# EAGLE design USB-CAN-Adapter (EAGLE 7.7.0)
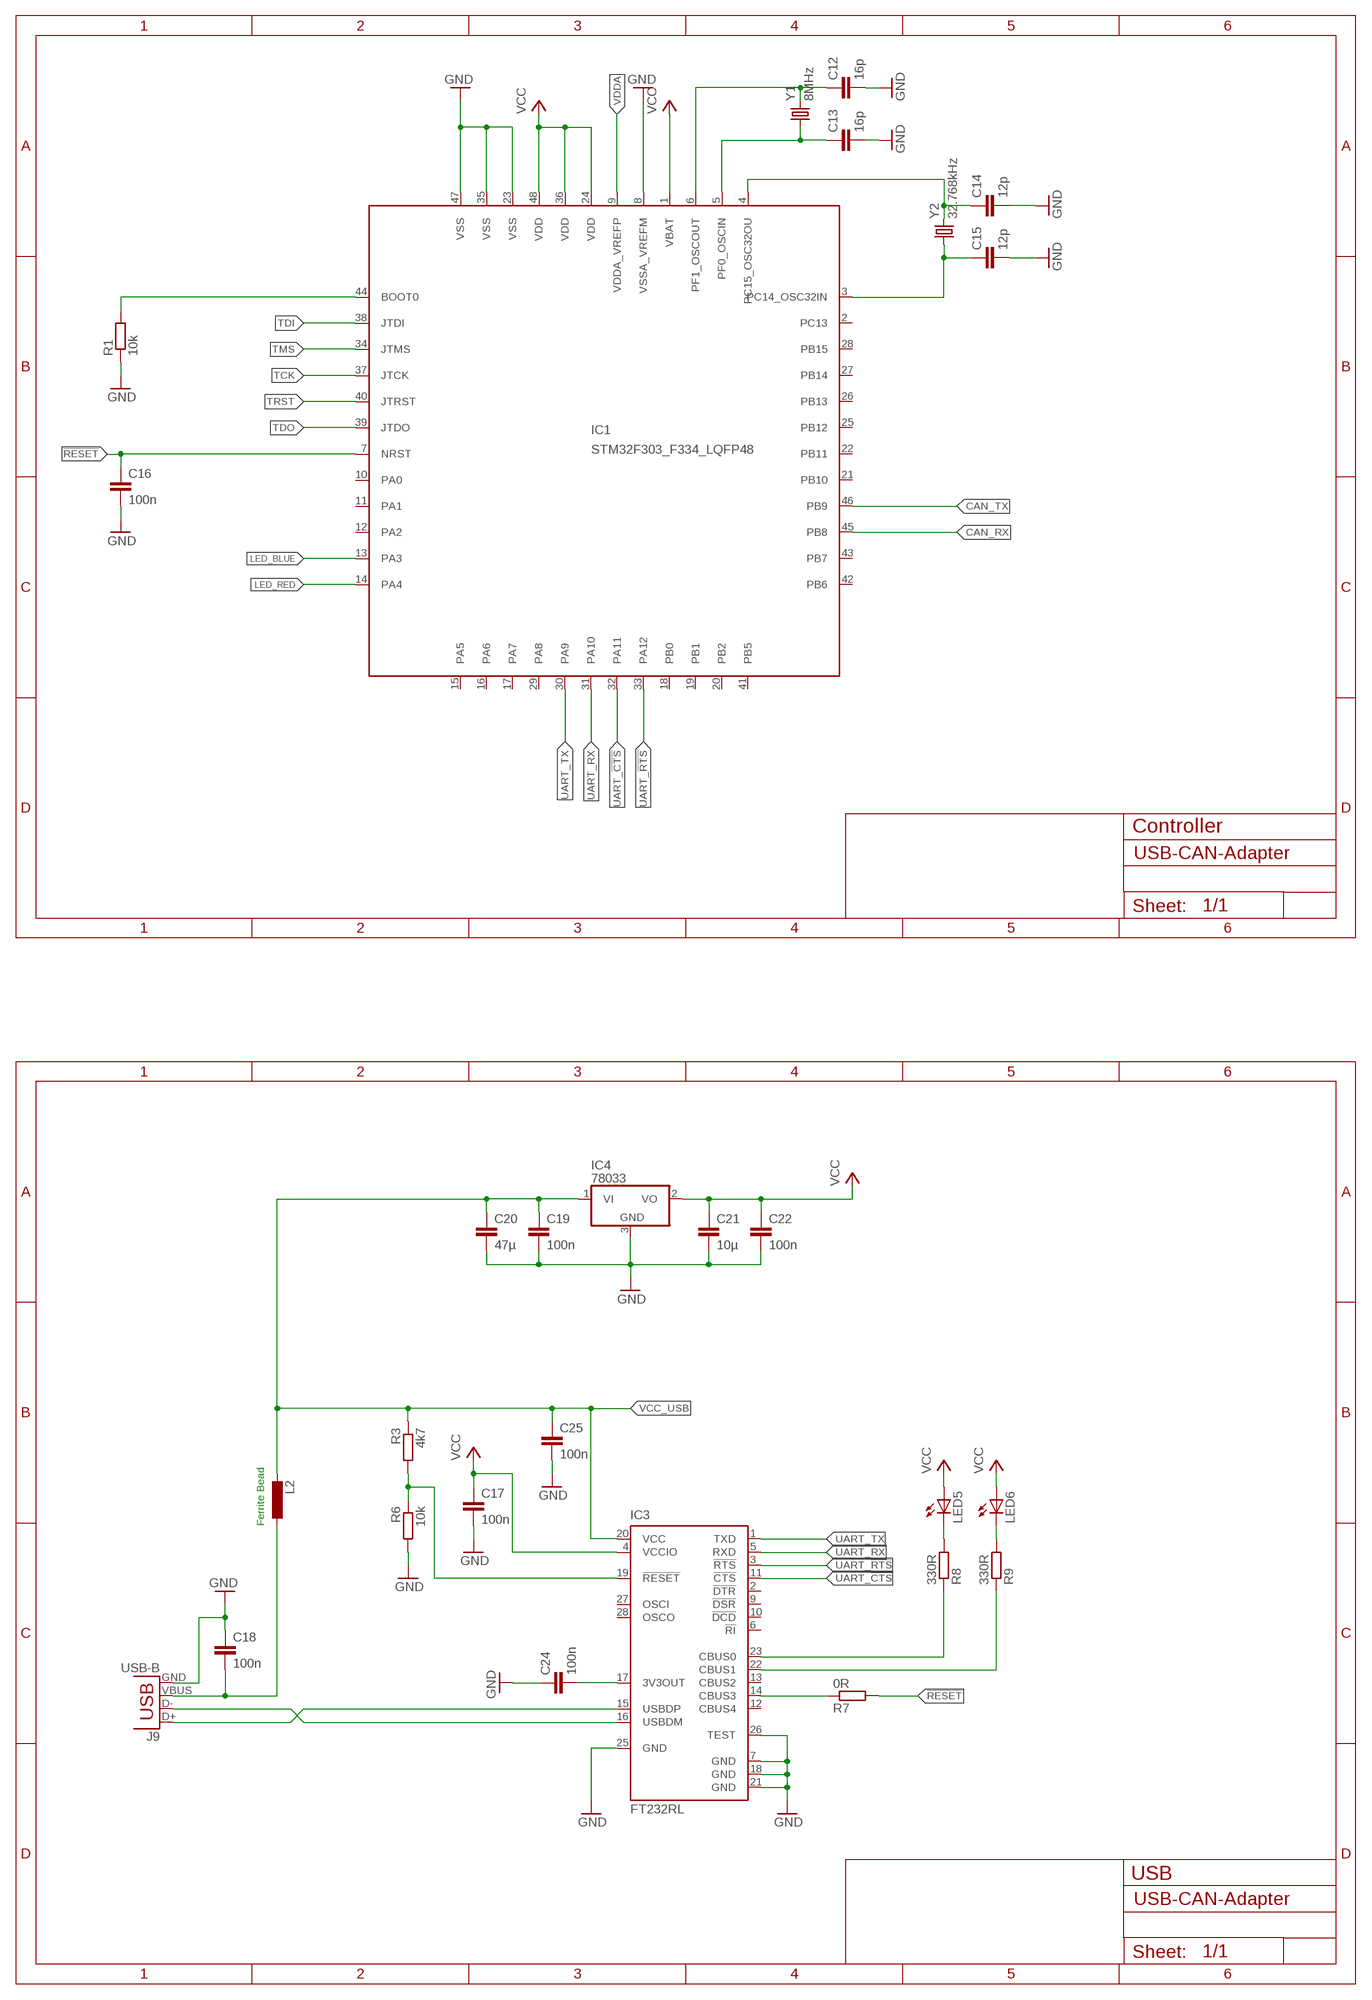
[diagram p0: schematic, sheet 1, part 1 of 2]
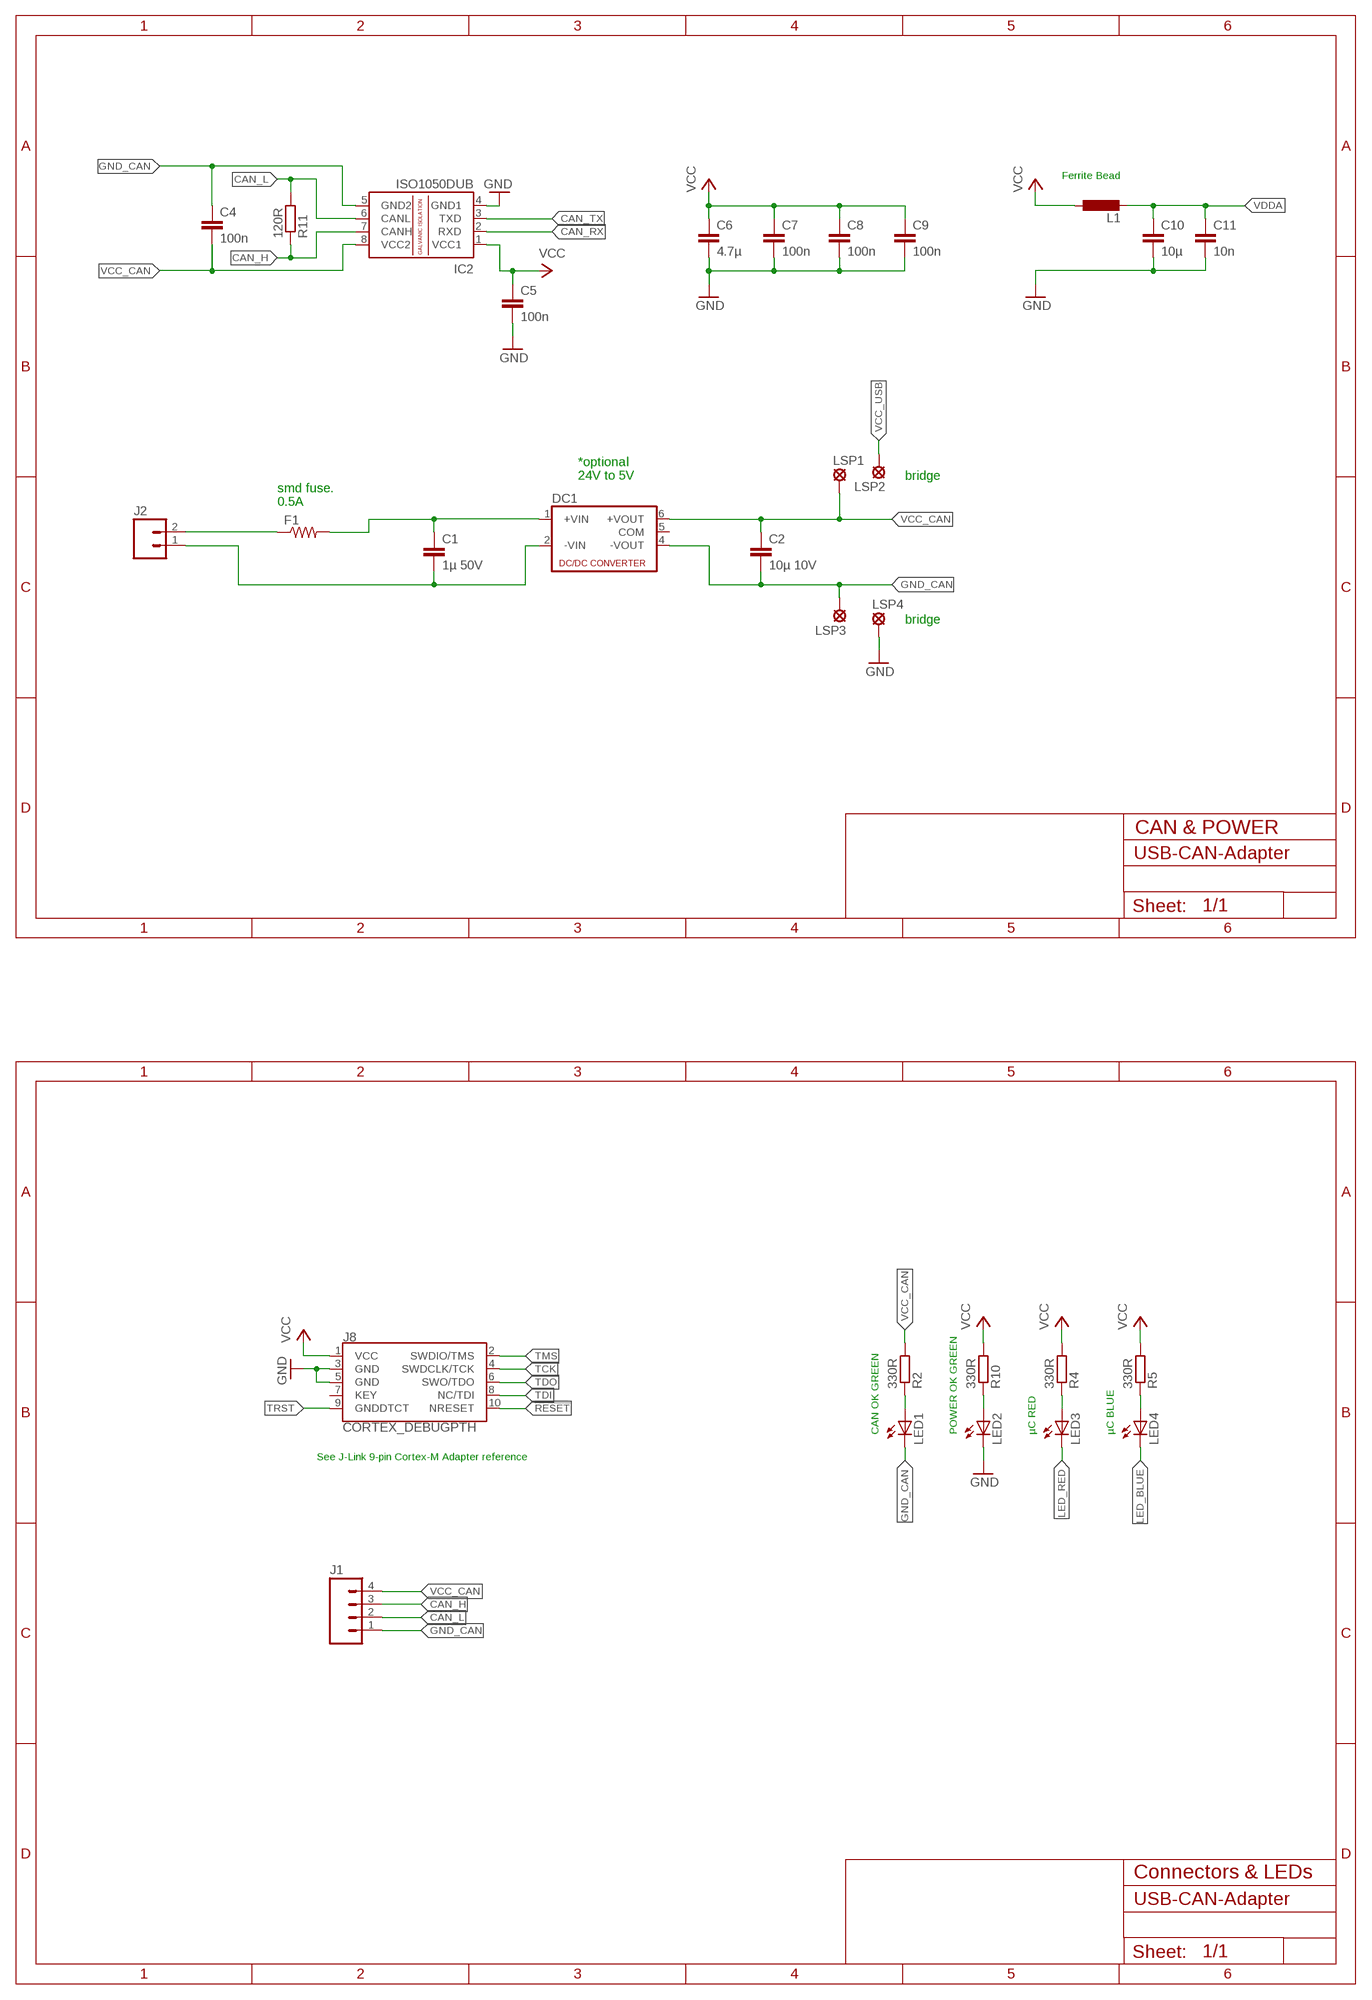
[diagram p1: schematic, sheet 1, part 2 of 2]

## Parts
C1  1µ 50V  C-EUC0805  [C0805]
C2  10µ 10V  C-EUC0805  [C0805]
C4  100n  C-EUC0805  [C0805]
C5  100n  C-EUC0805  [C0805]
C6  4.7µ  C-EUC0805  [C0805]
C7  100n  C-EUC0805  [C0805]
C8  100n  C-EUC0805  [C0805]
C9  100n  C-EUC0805  [C0805]
C10  10µ  C-EUC0805  [C0805]
C11  10n  C-EUC0805  [C0805]
C12  16p  C-EUC0805  [C0805]
C13  16p  C-EUC0805  [C0805]
C14  12p  C-EUC0805  [C0805]
C15  12p  C-EUC0805  [C0805]
C16  100n  C-EUC0805  [C0805]
C17  100n  C-EUC0805  [C0805]
C18  100n  C-EUC0805  [C0805]
C19  100n  C-EUC0805  [C0805]
C20  47µ  C-EUC0805  [C0805]
C21  10µ  C-EUC0805  [C0805]
C22  100n  C-EUC0805  [C0805]
C24  100n  C-EUC0805  [C0805]
C25  100n  C-EUC0805  [C0805]
DC1  NMA  [NMA]
F1  R-US_R0805  [R0805]
IC1  STM32F303_F334_LQFP48  [LQFP48_PACKAGE]
IC2  ISO1050DUB  [DUB-R-PDSO-G8]
IC3  FT232RL  [SSOP28]
IC4  78033  7805DT  [TO252]
J1  M04SCREW  [SCREWTERMINAL-3.5MM-4]
J2  M023.5MM  [SCREWTERMINAL-3.5MM-2]
J8  CORTEX_DEBUGPTH  [2X5-PTH-1.27MM]
J9  USB-B  USBPTH  [USB-B-PTH]
L1  L-EUL2012C  [L2012C]
L2  L-EUL2012C  [L2012C]
LED1  LEDCHIP-LED0805  [CHIP-LED0805]
LED2  LEDCHIP-LED0805  [CHIP-LED0805]
LED3  LEDCHIP-LED0805  [CHIP-LED0805]
LED4  LEDCHIP-LED0805  [CHIP-LED0805]
LED5  LEDCHIP-LED0805  [CHIP-LED0805]
LED6  LEDCHIP-LED0805  [CHIP-LED0805]
LSP1  LSP13  [LSP13]
LSP2  LSP13  [LSP13]
LSP3  LSP13  [LSP13]
LSP4  LSP13  [LSP13]
R1  10k  R-EU_R0805  [R0805]
R2  330R  R-EU_R0805  [R0805]
R3  4k7  R-EU_R0805  [R0805]
R4  330R  R-EU_R0805  [R0805]
R5  330R  R-EU_R0805  [R0805]
R6  10k  R-EU_R0805  [R0805]
R7  0R  R-EU_R0805  [R0805]
R8  330R  R-EU_R0805  [R0805]
R9  330R  R-EU_R0805  [R0805]
R10  330R  R-EU_R0805  [R0805]
R11  120R  R-EU_R0805  [R0805]
Y1  8MHz  CRYSTALCRYSTAL-SMD-5X3-12.288MHZ  [CRYSTAL-SMD-5X3]
Y2  32.768kHz  CRYSTAL3.2X1.5MM  [CRYSTAL-SMD-3.2X1.5MM]

## Nets
!RESET: C16.1 IC1.7(NRST) J8.10(NRESET) R7.2
CAN_H: IC2.7(CANH) J1.3 R11.1
CAN_L: IC2.6(CANL) J1.2 R11.2
CAN_RX: IC1.45(PB8) IC2.2(RXD)
CAN_TX: IC1.46(PB9) IC2.3(TXD)
GND: C5.2 C6.2 C7.2 C8.2 C9.2 C10.2 C11.2 C12.2 C13.2 C14.2 C15.2 C16.2 C17.2 C18.1 C19.2 C20.2 C21.2 C22.2 C24.1 C25.2 IC1.8(VSSA_VREFM) IC1.23(VSS) IC1.35(VSS) IC1.47(VSS) IC2.4(GND1) IC3.7(GND) IC3.18(GND) IC3.21(GND) IC3.25(GND) IC3.26(TEST) IC4.3(GND) J8.3(GND) J8.5(GND) J9.GND LED2.C LSP4.MP R1.1 R6.2
GND_CAN: C2.2 C4.1 DC1.4(-VOUT) IC2.5(GND2) J1.1 LED1.C LSP3.MP
LED_BLUE: IC1.13(PA3) LED4.C
LED_RED: IC1.14(PA4) LED3.C
N$1: F1.1 J2.2
N$2: C1.1 DC1.1(+VIN) F1.2
N$3: C1.2 DC1.2(-VIN) J2.1
N$4: IC1.44(BOOT0) R1.2
N$5: LED1.A R2.1
N$6: LED2.A R10.1
N$7: C12.1 IC1.6(PF1_OSCOUT) Y1.3
N$8: C13.1 IC1.5(PF0_OSCIN) Y1.1
N$9: LED3.A R4.1
N$10: LED4.A R5.1
N$11: C14.1 IC1.4(PC15_OSC32OU) Y2.P$2
N$12: C15.1 IC1.3(PC14_OSC32IN) Y2.P$1
N$13: IC3.16(USBDM) J9.D-
N$14: IC3.15(USBDP) J9.D+
N$15: IC3.19(!RESET) R3.2 R6.1
N$16: C18.2 J9.VBUS L2.1
N$17: IC3.14(CBUS3) R7.1
N$18: C24.2 IC3.17(3V3OUT)
N$24: IC3.23(CBUS0) R8.1
N$25: IC3.22(CBUS1) R9.1
N$26: LED5.C R8.2
N$27: LED6.C R9.2
TCK: IC1.37(JTCK) J8.4(SWDCLK/TCK)
TDI: IC1.38(JTDI) J8.8(NC/TDI)
TDO: IC1.39(JTDO) J8.6(SWO/TDO)
TMS: IC1.34(JTMS) J8.2(SWDIO/TMS)
TRST: IC1.40(JTRST) J8.9(GNDDTCT)
UART_!CTS: IC1.32(PA11) IC3.11(!CTS)
UART_!RTS: IC1.33(PA12) IC3.3(!RTS)
UART_RX: IC1.31(PA10) IC3.5(RXD)
UART_TX: IC1.30(PA9) IC3.1(TXD)
VCC: C5.1 C6.1 C7.1 C8.1 C9.1 C17.1 C21.1 C22.1 IC1.1(VBAT) IC1.24(VDD) IC1.36(VDD) IC1.48(VDD) IC2.1(VCC1) IC3.4(VCCIO) IC4.2(VO) J8.1(VCC) L1.1 LED5.A LED6.A R4.2 R5.2 R10.2
VCC_CAN: C2.1 C4.2 DC1.6(+VOUT) IC2.8(VCC2) J1.4 LSP1.MP R2.2
VCC_USB: C19.1 C20.1 C25.1 IC3.20(VCC) IC4.1(VI) L2.2 LSP2.MP R3.1
VDDA: C10.1 C11.1 IC1.9(VDDA_VREFP) L1.2
Unconnected: DC1.5(COM) IC1.2(PC13) IC1.10(PA0) IC1.11(PA1) IC1.12(PA2) IC1.15(PA5) IC1.16(PA6) IC1.17(PA7) IC1.18(PB0) IC1.19(PB1) IC1.20(PB2) IC1.21(PB10) IC1.22(PB11) IC1.25(PB12) IC1.26(PB13) IC1.27(PB14) IC1.28(PB15) IC1.29(PA8) IC1.41(PB5) IC1.42(PB6) IC1.43(PB7) IC3.2(!DTR) IC3.6(!RI) IC3.9(!DSR) IC3.10(!DCD) IC3.12(CBUS4) IC3.13(CBUS2) IC3.27(OSCI) IC3.28(OSCO) J8.7(KEY)

## Notes on the sheet
- Ferrite Bead
- *optional
  24V to 5V
- bridge
- smd fuse.
  0.5A
- bridge
- Controller | CAN & POWER
- CAN OK GREEN | POWER OK GREEN | µC RED | µC BLUE
- See J-Link 9-pin Cortex-M Adapter reference
- Ferrite Bead
- USB | Connectors & LEDs

## Library data of the parts
C1 C2 C4-C22 C24 C25 = rcl:C-EU: CAPACITOR, European symbol
DC1 = dc-dc-converter:NMA: DC-DC CONVERTER; MF: C & D TECHNOLOGIES, INC; MPN: NMA0515SC; OC_FARNELL: 1021434; OC_NEWARK: 61K3064
F1 = rcl:R-US_: RESISTOR, American symbol
IC1 = STM32F303:STM32F303_F334_LQFP48: STM32F303_F334_LQFP48 edit this description Auto generated by make-symbol-device-package-bsdl.ulp Rev. 44 Source: STM32F303_F334_LQFP48.bsd
IC2 = texas:ISO1050: ISOLATED CAN TRANSCEIVER Source: http://focus.ti.com/lit/ds/symlink/iso1050.pdf; MPN: ISO1050DUBR; OC_FARNELL: 1755712; OC_NEWARK: 14R9899
IC3 = ftdichip:FT232R: Source: http://www.ftdichip.com/Documents/DataSheets/DS_FT232R_v104.pdf; MPN: FT232RL; OC_FARNELL: 1146032; OC_NEWARK: 91K9918
IC4 = linear:78*: Positive VOLTAGE REGULATOR Source: http://cache.national.com/ds/LM/LM78L05.pdf http://www.fairchildsemi.com/ds/LM/LM7805.pdf
J1 = SparkFun-Connectors:M04: Header 4 Standard 4-pin 0.1" header. Use with straight break away headers (SKU : PRT-00116), right angle break away headers (PRT-00553), swiss pins (PRT-00743), machine pins (PRT-00117), and female headers (PRT-00115). Molex polarized connector foot print use with SKU : PRT-08231 with associated crimp pins and housings. 1MM SMD Version SKU: PRT-10208; PROD_ID: Combine 2x8399
J2 = SparkFun-Connectors:M02: Standard 2-pin 0.1" header. Use with - straight break away headers ( PRT-00116) - right angle break away headers (PRT-00553) - swiss pins (PRT-00743) - machine pins (PRT-00117) - female headers (PRT-00115) Molex polarized connector foot print use with: PRT-08233 with associated crimp pins and housings. 2.54_SCREWTERM for use with PRT-10571. 3.5mm Screw Terminal footprints for PRT-08084 5mm Screw Terminal footprints for use with PRT-08432; PROD_ID: CONN-08399
J8 = SparkFun-Connectors:CORTEX_DEBUG: Cortex Debug Connector Datasheet <http://infocenter.arm.com/help/topic/com.arm.doc.faqs/attached/13634/cortex_debug_connectors.pdf>
J9 = SparkFun-Connectors:USB: USB Connectors USB-B-PTH is fully proven SKU : PRT-00139/CONN-08278 USB-miniB is fully proven SKU : PRT-00587 USB-A-PCB is untested. USB-A-H is throughly reviewed, but untested. Spark Fun Electronics SKU : PRT-00437 USB-B-SMT is throughly reviewed, but untested. Needs silkscreen touching up. USB-A-S has not been used/tested USB-MB-H has not been used/tested USB-MICROB has been used. CONN-09505; PROD_ID: CONN-08278
L1 L2 = rcl:L-EU: INDUCTOR, European symbol
LED1-LED6 = led:LED: LED OSRAM: - CHIPLED LG R971, LG N971, LY N971, LG Q971, LY Q971, LO R971, LY R971 LH N974, LH R974 LS Q976, LO Q976, LY Q976 LO Q996 - Hyper CHIPLED LW Q18S LB Q993, LB Q99A, LB R99A - SideLED LS A670, LO A670, LY A670, LG A670, LP A670 LB A673, LV A673, LT A673, LW A673 LH A674 LY A675 LS A676, LA A676, LO A676, LY A676, LW A676 LS A679, LY A679, LG A679 - Hyper Micro SIDELED® LS Y876, LA Y876, LO Y876, LY Y876 LT Y87S - SmartLED LW L88C, LW L88S LB L89C, LB L89S, LG L890 LS L89K, LO L89K, LY L89K LS L896, LA L896, LO L896, LY L896 - TOPLED LS T670, LO T670, LY T670, LG T670, LP T670 LSG T670, LSP T670, LSY T670, LOP T670, LYG T670 LG T671, LOG T671, LSG T671 LB T673, LV T673, LT T673, LW T673 LH T674 LS T676, LA T676, LO T676, LY T676, LB T676, LH T676, LSB T676, LW T676 LB T67C, LV T67C, LT T67C, LS T67K, LO T67K, LY T67K, LW E67C LS E67B, LA E67B, LO E67B, LY E67B, LB E67C, LV E67C, LT E67C LW T67C LS T679, LY T679, LG T679 LS T770, LO T770, LY T770, LG T770, LP T770 LB T773, LV T773, LT T773, LW T773 LH T774 LS E675, LA E675, LY E675, LS T675 LS T776, LA T776, LO T776, LY T776, LB T776 LHGB T686 LT T68C, LB T68C - Hyper Mini TOPLED® LB M676 - Mini TOPLED Santana® LG M470 LS M47K, LO M47K, LY M47K Source: http://www.osram.convergy.de LUXEON: - LUMILED® LXK2-PW12-R00, LXK2-PW12-S00, LXK2-PW14-U00, LXK2-PW14-V00 LXK2-PM12-R00, LXK2-PM12-S00, LXK2-PM14-U00 LXK2-PE12-Q00, LXK2-PE12-R00, LXK2-PE12-S00, LXK2-PE14-T00, LXK2-PE14-U00 LXK2-PB12-K00, LXK2-PB12-L00, LXK2-PB12-M00, LXK2-PB14-N00, LXK2-PB14-P00, LXK2-PB14-Q00 LXK2-PR12-L00, LXK2-PR12-M00, LXK2-PR14-Q00, LXK2-PR14-R00 LXK2-PD12-Q00, LXK2-PD12-R00, LXK2-PD12-S00 LXK2-PH12-R00, LXK2-PH12-S00 LXK2-PL12-P00, LXK2-PL12-Q00, LXK2-PL12-R00 Source: www.luxeon.com KINGBRIGHT: KA-3528ASYC Source: www.kingbright.com
LSP1-LSP4 = solpad:LSP13: SOLDER PAD drill 1.3 mm, distributor Buerklin, 12H562
R1-R11 = rcl:R-EU_: RESISTOR, European symbol
Y1 = SparkFun-FreqCtrl:CRYSTAL: Various standard crystals. Proven footprints.; PROD_ID: XTAL-09653; VALUE: 12.288MHz
Y2 = SparkFun-FreqCtrl:CRYSTAL: Various standard crystals. Proven footprints.; PROD_ID: XTAL-13062

## Board
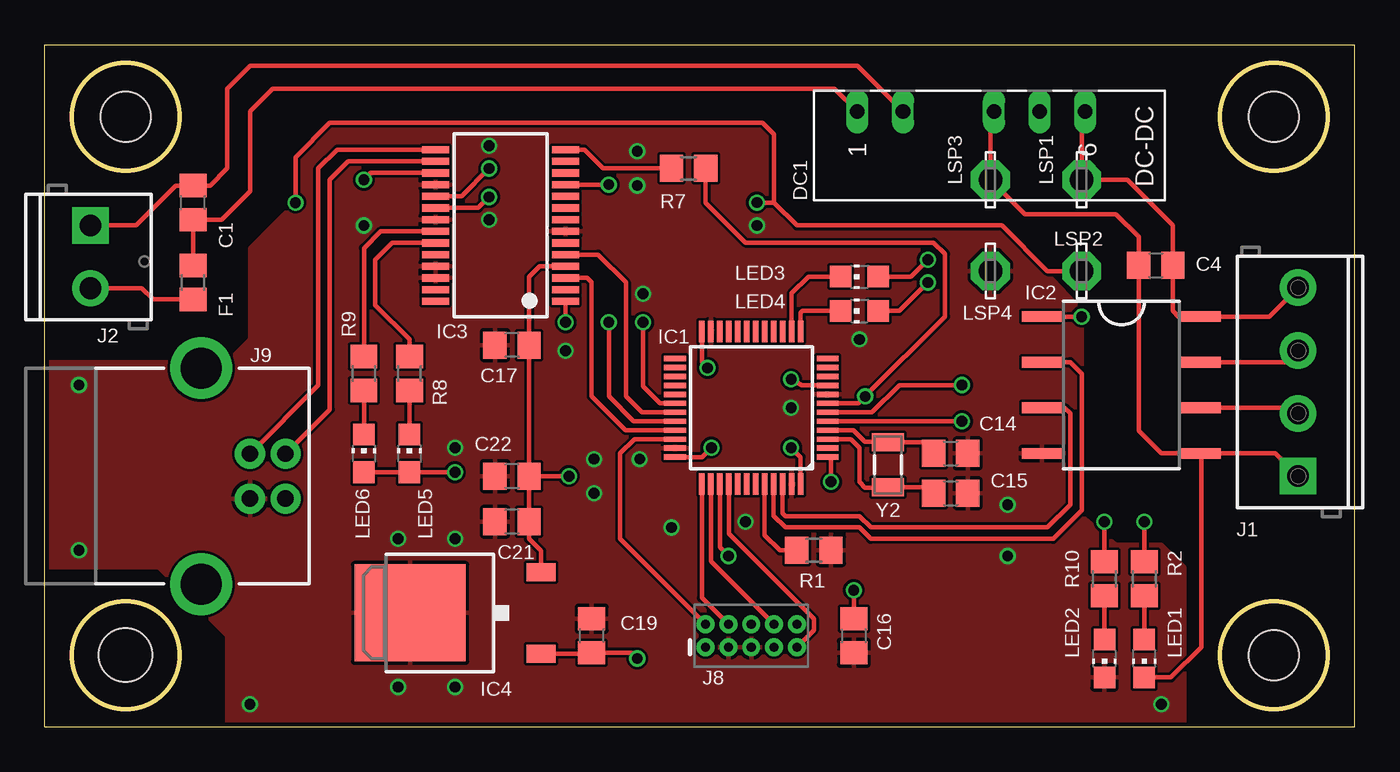
[diagram p2: board, top side]
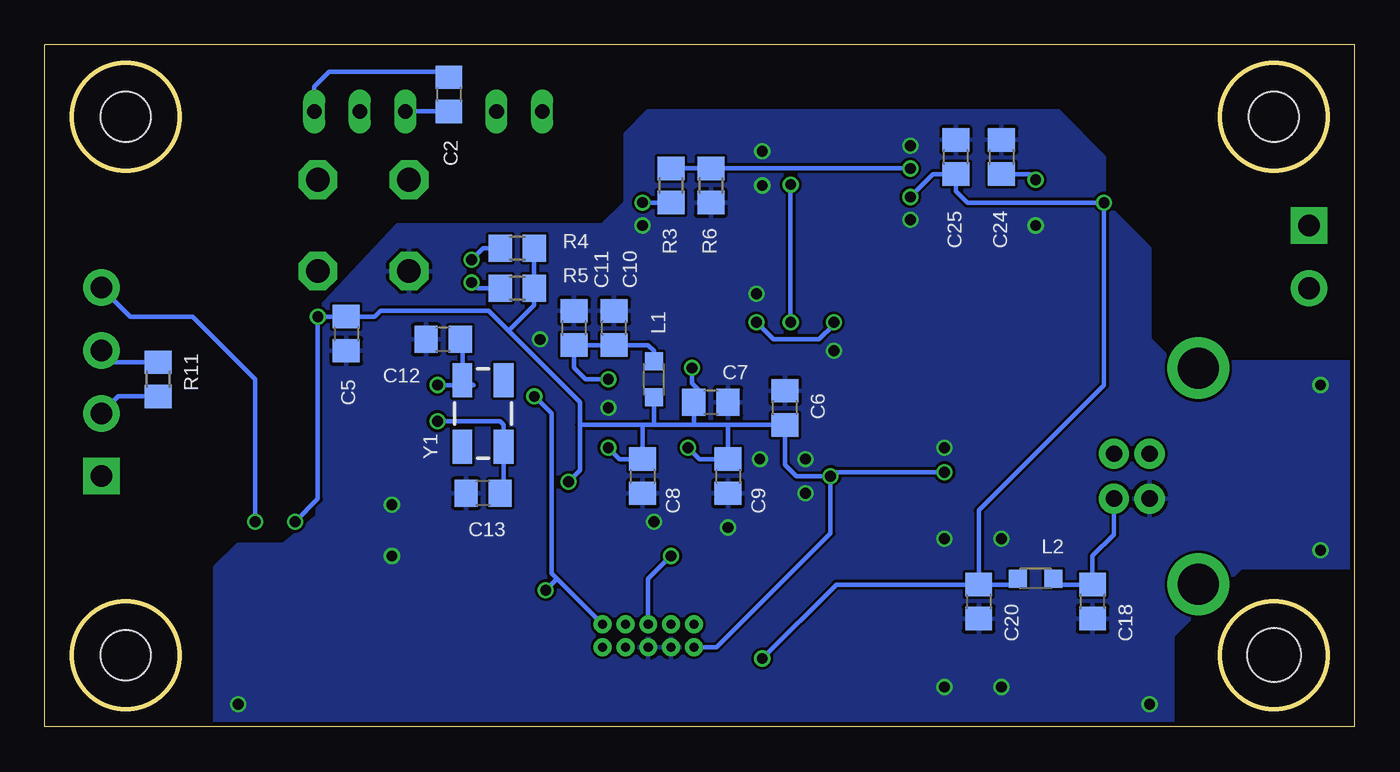
[diagram p3: board, bottom side, seen from below]

Size 73 x 38 mm. Coordinates in mm from the lower left corner, seen from the top.
Outline: 0,0 73,0 73,38 0,38 0,0
Outline: circle at 4.5,34 radius 3
Outline: circle at 4.5,4 radius 3
Outline: circle at 68.5,4 radius 3
Outline: circle at 68.5,34 radius 3
Copper layers (1*16): Top 0.018mm / dielectric 1.55mm / Bottom 0.018mm
Design rules "eC_2Layer_PClass6_BaseCopperO18_eCDefault": minimum track width 0.15mm, minimum drill 0.35mm, track to track 0.15mm, track to pad 0.15mm, pad to pad 0.15mm, via to via 0.15mm, smd to smd 0mil, copper to edge 0.25mm, drill to drill 0.35mm, minimum pad ring 0.175mm, minimum via ring 0.125mm, stop-mask expansion 0mil, vias tented up to drill 0.45mm, thermal gap 0.2mm
Holes 2.8 mm at 4.5,34 68.5,4 68.5,34
Holes 3 mm at 4.5,4

### Footprints (pad centres in the part's own frame; a part is rotated, then mirrored left to right if it is on the bottom)
C0805 = smd 1.3 x 1.5: 1 -0.95,0; 2 0.95,0
NMA = drill 0.813 long: 1 0,6.35; 2 0,3.81; 4 0,-1.27; 5 0,-3.81; 6 0,-6.35
R0805 = smd 1.3 x 1.5: 1 -0.95,0; 2 0.95,0
LQFP48_PACKAGE = smd 1.2 x 0.3: 1 -4.25,2.75; 2 -4.25,2.25; 3 -4.25,1.75; 4 -4.25,1.25; 5 -4.25,0.75; 6 -4.25,0.25; 7 -4.25,-0.25; 8 -4.25,-0.75; 9 -4.25,-1.25; 10 -4.25,-1.75; 11 -4.25,-2.25; 12 -4.25,-2.75; 25 4.25,-2.75; 26 4.25,-2.25; 27 4.25,-1.75; 28 4.25,-1.25; 29 4.25,-0.75; 30 4.25,-0.25; 31 4.25,0.25; 32 4.25,0.75; 33 4.25,1.25; 34 4.25,1.75; 35 4.25,2.25; 36 4.25,2.75 | smd 0.3 x 1.2: 13 -2.75,-4.25; 14 -2.25,-4.25; 15 -1.75,-4.25; 16 -1.25,-4.25; 17 -0.75,-4.25; 18 -0.25,-4.25; 19 0.25,-4.25; 20 0.75,-4.25; 21 1.25,-4.25; 22 1.75,-4.25; 23 2.25,-4.25; 24 2.75,-4.25; 37 2.75,4.25; 38 2.25,4.25; 39 1.75,4.25; 40 1.25,4.25; 41 0.75,4.25; 42 0.25,4.25; 43 -0.25,4.25; 44 -0.75,4.25; 45 -1.25,4.25; 46 -1.75,4.25; 47 -2.25,4.25; 48 -2.75,4.25
DUB-R-PDSO-G8 = smd 0.6 x 2.2: 1 -3.81,-4.445; 2 -1.27,-4.445; 3 1.27,-4.445; 4 3.81,-4.445; 5 3.81,4.445; 6 1.27,4.445; 7 -1.27,4.445; 8 -3.81,4.445
SSOP28 = smd 0.4 x 1.5: 1 -4.225,-3.625; 2 -3.575,-3.625; 3 -2.925,-3.625; 4 -2.275,-3.625; 5 -1.625,-3.625; 6 -0.975,-3.625; 7 -0.325,-3.625; 8 0.325,-3.625; 9 0.975,-3.625; 10 1.625,-3.625; 11 2.275,-3.625; 12 2.925,-3.625; 13 3.575,-3.625; 14 4.225,-3.625; 15 4.225,3.625; 16 3.575,3.625; 17 2.925,3.625; 18 2.275,3.625; 19 1.625,3.625; 20 0.975,3.625; 21 0.325,3.625; 22 -0.325,3.625; 23 -0.975,3.625; 24 -1.625,3.625; 25 -2.275,3.625; 26 -2.925,3.625; 27 -3.575,3.625; 28 -4.225,3.625
TO252 = smd 1 x 1.6: 1 -2.28,-4.8; 2 2.28,-4.8 | smd 5.4 x 6.2: 3 0,2.5
SCREWTERMINAL-3.5MM-4 = drill 1.2 pad 2.032 square: 1 0,0 | drill 1.2 pad 2.032: 2 3.5,0; 3 7,0; 4 10.5,0
SCREWTERMINAL-3.5MM-2 = drill 1.2 pad 2.032 square: 1 0,0 | drill 1.2 pad 2.032: 2 3.5,0
2X5-PTH-1.27MM = drill 0.508 pad 1: 1 -2.54,-0.635; 2 -2.54,0.635; 3 -1.27,-0.635; 4 -1.27,0.635; 5 0,-0.635; 6 0,0.635; 7 1.27,-0.635; 8 1.27,0.635; 9 2.54,-0.635; 10 2.54,0.635
USB-B-PTH = drill 0.914 pad 1.676: D+ 0,1.25; D- 1.981,1.25; GND 0,-1.25; VBUS 1.981,-1.25 | drill 2.286: S1 -2.718,-6.02; S2 -2.718,6.02
L2012C = smd 1 x 1: 1 -1,0; 2 1,0
CHIP-LED0805 = smd 1.2 x 1.2: A 0,-1.05; C 0,1.05
LSP13 = drill 1.321 pad 2.159 octagon: MP 0,0
CRYSTAL-SMD-5X3 = smd 1.9 x 1.1: 1 -1.85,-1.15; 2 1.85,-1.15; 3 1.85,1.15; 4 -1.85,1.15
CRYSTAL-SMD-3.2X1.5MM = smd 1 x 1.8: P$1 -1.25,0; P$2 1.25,0

### Placement (x,y rotation side)
C1  8.26,29.21 90 top
C2  50.48,35.24 270 bottom
C4  61.91,25.72 0 top
C5  56.2,21.91 270 bottom
C6  31.75,17.78 90 bottom
C7  35.88,18.1 0 bottom
C8  39.69,13.97 270 bottom
C9  34.92,13.97 270 bottom
C10  41.27,22.23 90 bottom
C11  43.5,22.23 90 bottom
C12  50.8,21.59 180 bottom
C13  48.58,13.02 180 bottom
C14  50.48,15.24 0 top
C15  50.48,13.02 0 top
C16  45.09,5.08 270 top
C17  26.04,21.27 180 top
C18  14.61,6.99 90 bottom
C19  30.48,5.08 90 top
C20  20.95,6.99 270 bottom
C21  26.04,11.43 180 top
C22  26.04,13.97 180 top
C24  19.68,31.75 270 bottom
C25  22.23,31.75 90 bottom
DC1  51.63,34.29 90 top
F1  8.26,24.77 90 top
IC1  39.37,17.78 180 top
IC2  60.01,19.05 270 top
IC3  25.4,27.94 90 top
IC4  22.86,6.35 90 top
J1  69.85,13.97 90 top
J2  2.54,27.94 270 top
J8  39.37,5.08 0 top
J9  11.43,13.97 0 top
L1  39.05,19.37 90 bottom
L2  17.78,8.26 180 bottom
LED1  61.28,3.81 180 top
LED2  59.05,3.81 180 top
LED3  45.4,25.08 90 top
LED4  45.4,23.18 90 top
LED5  20.32,15.24 0 top
LED6  17.78,15.24 0 top
LSP1  57.78,30.48 90 top
LSP2  57.78,25.4 90 top
LSP3  52.7,30.48 90 top
LSP4  52.7,25.4 90 top
R1  42.86,9.84 180 top
R2  61.28,8.26 90 top
R3  38.1,30.16 90 bottom
R4  46.67,26.67 0 bottom
R5  46.67,24.45 0 bottom
R6  35.88,30.16 270 bottom
R7  35.88,31.11 0 top
R8  20.32,19.68 270 top
R9  17.78,19.68 270 top
R10  59.05,8.26 90 top
R11  66.67,19.37 270 bottom
Y1  48.58,17.46 90 bottom
Y2  46.99,14.61 90 top

### Tracks (layer width: path | path; a pad name or v marks a point on that pad's centre or on a via)
!RESET  (via drill 0.6)
  Top 0.254: R7.2 36.83,29.21 39.05,26.99 49.53,26.99 50.16,26.35 50.16,22.86 v45.72,18.41 45.34,18.03 IC1.7 | C16.1 v45.09,7.62
  Bottom 0.254: J8.10 44.45,8.26 | 44.45,8.26 44.77,8.57 44.77,17.46 v45.72,18.41 | v45.09,7.62 44.45,8.26
CAN_H
  Top 0.254: IC2.7 69.2,20.32 J1.3
  Bottom 0.254: R11.1 69.2,20.32 J1.3
CAN_L
  Top 0.254: IC2.6 69.54,17.78 J1.2
  Bottom 0.254: R11.2 68.9,18.42 J1.2
CAN_RX
  Top 0.254: IC2.2 57.15,20.32 57.78,19.68 57.78,12.06 56.2,10.48 46.04,10.48 45.4,11.11 41.27,11.11 40.62,11.77 IC1.45
CAN_TX
  Top 0.254: IC2.3 56.83,17.78 57.15,17.46 57.15,12.38 55.88,11.11 46.04,11.11 45.4,11.75 41.27,11.75 41.12,11.9 IC1.46
GND  (via drill 0.6)
  other vias: 17.78,27.94 1.91,19.05 19.68,2.22 19.68,10.48 22.86,10.48 22.86,2.22 22.86,15.56 33.02,32.07 24.77,32.38 33.34,24.13 29.02,20.95 33.15,14.92 30.61,14.92 30.61,13.02 24.77,28.26 33.02,30.16 39.05,11.43 39.69,27.94 53.66,12.38 53.66,9.53 41.59,17.78 45.4,21.59 11.43,1.27 62.23,1.27 34.92,11.11 1.91,9.84
  pour Top: 0,20.32 10.16,20.32 11.43,21.59 11.43,26.67 13.97,29.21 13.97,31.75 16.51,34.29 39.37,34.29 40.64,33.02 40.64,29.21 41.91,27.94 53.34,27.94 57.78,23.18 57.78,11.75 59.69,10.16 62.23,10.16 63.5,8.89 63.5,0 10.16,0 10.16,5.08 6.35,8.89 0,8.89
  pour Bottom: 0,20.32 0,8.89 6.35,8.89 10.16,5.08 10.16,0 63.5,0 63.5,8.89 62.23,10.16 59.69,10.16 57.78,11.75 57.78,23.18 53.34,27.94 41.91,27.94 40.64,29.21 40.64,33.02 39.37,34.29 16.51,34.29 13.97,31.75 13.97,29.21 11.43,26.67 11.43,21.59 10.16,20.32
GND_CAN
  Top 0.254: DC1.4 52.7,34.09 LSP3.MP 54.61,28.57 59.69,28.57 60.96,27.3 C4.1 60.96,16.51 62.23,15.24 IC2.5 | IC2.5 68.58,15.24 J1.1 | LED1.C 62.77,2.76 64.45,4.45 IC2.5
  Bottom 0.254: C2.2 DC1.4
LED_BLUE
  Top 0.254: IC1.13 42.12,23.07 42.23,23.18 LED4.C
LED_RED
  Top 0.254: LED3.C 42.55,25.08 41.62,24.16 IC1.14
N$1
  Top 0.254: F1.1 6.03,23.82 5.41,24.44 J2.2
N$2
  Top 0.254: F1.2 C1.1 9.85,28.26 11.43,29.84 11.43,34.29 12.7,35.56 44.02,35.56 DC1.1
N$3
  Top 0.254: J2.1 5.08,27.94 7.3,30.16 C1.2 9.21,30.16 10.16,31.11 10.16,35.56 11.43,36.83 45.28,36.83 DC1.2
N$4
  Top 0.254: IC1.44 40.12,10.68 40.96,9.84 R1.2
N$5
  Top 0.254: LED1.A R2.1
N$6
  Top 0.254: LED2.A R10.1
N$7  (via drill 0.6)
  Top 0.254: IC1.6 46.1,17.53 47.62,19.05 v51.12,19.05
  Bottom 0.254: v51.12,19.05 49.09,19.05 Y1.3 49.73,21.71 C12.1
N$8  (via drill 0.6)
  Top 0.254: IC1.5 v51.12,17.03
  Bottom 0.254: C13.1 47.43,12.82 Y1.1 47.43,16.83 47.62,17.03 v51.12,17.03
N$9  (via drill 0.6)
  Top 0.254: LED3.A 48.26,25.08 v49.21,26.04
  Bottom 0.254: v49.21,26.04 48.58,26.67 R4.1
N$10  (via drill 0.6)
  Top 0.254: LED4.A 47.62,23.18 v49.21,24.77
  Bottom 0.254: v49.21,24.77 48.9,24.45 R5.1
N$11
  Top 0.254: IC1.4 45.06,16.53 45.72,15.88 46.97,15.88 Y2.P$2 48.92,15.86 C14.1 49.22,14.92
N$12
  Top 0.254: IC1.3 44.93,16.03 45.4,15.56 45.4,13.65 45.72,13.34 46.97,13.34 Y2.P$1 49.2,13.36 C15.1
N$13
  Top 0.254: IC3.16 16.91,31.52 15.88,30.48 15.88,17.68 J9.D-
N$14
  Top 0.254: IC3.15 16.29,32.16 15.24,31.11 15.24,19.03 J9.D+
N$15  (via drill 0.6)
  Top 0.254: IC3.19 23.21,29.57 v24.77,31.11
  Bottom 0.254: v24.77,31.11 R6.1 R3.2
N$16
  Bottom 0.254: J9.VBUS 13.41,10.72 14.61,9.53 C18.2 16.46,7.93 L2.1
N$17
  Top 0.254: IC3.14 30.07,32.16 31.11,31.11 R7.1
N$18  (via drill 0.6)
  Top 0.254: IC3.17 18.16,30.86 v17.78,30.48
  Bottom 0.254: C24.2 18.1,30.8 v17.78,30.48
N$24
  Top 0.254: IC3.23 19.34,26.96 18.41,26.04 18.41,23.5 20.32,21.59 R8.1
N$25
  Top 0.254: IC3.22 18.73,27.61 17.78,26.67 R9.1
N$26
  Top 0.254: LED5.C R8.2
N$27
  Top 0.254: LED6.C R9.2
TCK
  Top 0.254: IC1.37 36.62,7.2 J8.4
TDI
  Top 0.254: IC1.38 37.12,9.23 J8.8
TDO  (via drill 0.6)
  Top 0.254: IC1.39 37.62,10.01 v38.1,9.53
  Bottom 0.254: v38.1,9.53 39.37,8.26 J8.6
TMS
  Top 0.254: IC1.34 32.86,16.03 32.07,15.24 32.07,10.48 J8.2
TRST
  Top 0.254: IC1.40 38.12,10.78 42.86,6.03 42.86,5.4 J8.9
UART_!CTS  (via drill 0.6)
  Top 0.254: IC1.32 32.82,17.03 31.43,18.41 v31.43,22.54 | IC3.11 v31.43,30.21
  Bottom 0.254: v31.43,30.21 v31.43,22.54
UART_!RTS
  Top 0.254: IC1.33 32.37,16.53 30.48,18.41 30.48,24.77 30.23,25.02 IC3.3
UART_RX
  Top 0.254: IC1.31 33.27,17.53 32.38,18.41 32.38,24.77 30.84,26.32 IC3.5
UART_TX  (via drill 0.6)
  Top 0.254: IC1.30 34.29,18.03 33.34,18.98 v33.34,22.54 | v29.02,22.54 IC3.1
  Bottom 0.254: v29.02,22.54 29.02,22.41 29.84,21.59 32.38,21.59 v33.34,22.54
VCC  (via drill 0.6)
  Top 0.254: IC4.2 27.66,9.8 26.98,10.48 C21.1 C22.1 | LED6.A LED5.A v22.86,14.19 | v29.21,13.97 C22.1 | IC1.48 42.12,15.03 v41.59,15.56 | v37.15,15.56 36.62,15.03 IC1.36 | IC1.24 36.62,20.32 v36.94,20 | IC3.4 27.57,25.66 26.99,25.08 C17.1 C22.1 | IC1.1 43.81,15.03 v43.81,13.65 | IC2.1 v57.78,22.86 | R10.2 v59.05,11.43
  Bottom 0.254: v22.86,14.19 28.99,14.19 v29.21,13.97 | v29.21,13.97 31.11,13.97 31.75,14.61 C6.1 34.92,16.83 | 34.92,16.83 C9.1 36.51,14.92 v37.15,15.56 | 36.83,16.83 C7.1 36.51,18.73 36.94,19.16 v36.94,20 | 36.83,16.83 34.92,16.83 | v41.59,15.56 40.96,14.92 C8.1 39.69,16.83 | 39.05,16.83 36.83,16.83 | L1.1 39.05,16.83 | 39.05,16.83 39.69,16.83 | J8.1 35.56,4.45 29.21,10.79 v29.21,13.97 | 43.18,16.83 39.69,16.83 | 43.18,16.83 43.18,14.29 v43.81,13.65 | 43.18,16.83 43.18,18.1 45.09,20.01 47.15,22.07 | 47.15,22.07 48.26,23.18 54.29,23.18 54.61,22.86 C5.1 v57.78,22.86 57.78,12.7 v59.05,11.43 | R4.2 R5.2 45.72,23.49 47.15,22.07
VCC_CAN  (via drill 0.6)
  Top 0.254: DC1.6 57.78,34.09 LSP1.MP 60.33,30.48 62.87,27.94 C4.2 62.86,23.18 63.18,22.86 IC2.8 68.24,22.86 J1.4 | R2.2 v61.28,11.43
  Bottom 0.254: C2.1 50.48,36.51 57.15,36.51 57.98,35.68 DC1.6 | v61.28,11.43 61.28,19.37 64.77,22.86 68.24,22.86 J1.4
VCC_USB  (via drill 0.6)
  Top 0.254: 40.64,29.21 40.64,33.02 40.01,33.66 15.88,33.66 13.97,31.75 v13.97,29.21 | v33.02,3.81 32.7,4.13 C19.1 30.42,4.07 IC4.1 | LSP2.MP 55.88,25.4 53.34,27.94 41.91,27.94 40.64,29.21 | IC3.20 24.15,28.91 v24.77,29.53 | v39.69,29.21 40.64,29.21
  Bottom 0.254: L2.2 19.1,7.93 C20.1 | C20.1 28.89,7.93 v33.02,3.81 | C20.1 20.95,12.06 13.97,19.05 v13.97,29.21 21.59,29.21 22.23,29.84 C25.1 23.49,30.8 v24.77,29.53 | R3.1 v39.69,29.21
VDDA  (via drill 0.6)
  Top 0.254: IC1.9 42.21,19.03 v41.59,19.37
  Bottom 0.254: 39.05,20.32 L1.2 39.05,20.95 39.37,21.27 C10.1 C11.1 43.5,20 42.86,19.37 v41.59,19.37